# EAGLE design PIC SENSOR-BOARD (EAGLE 9.2.2)

## Sheet 1 of 2
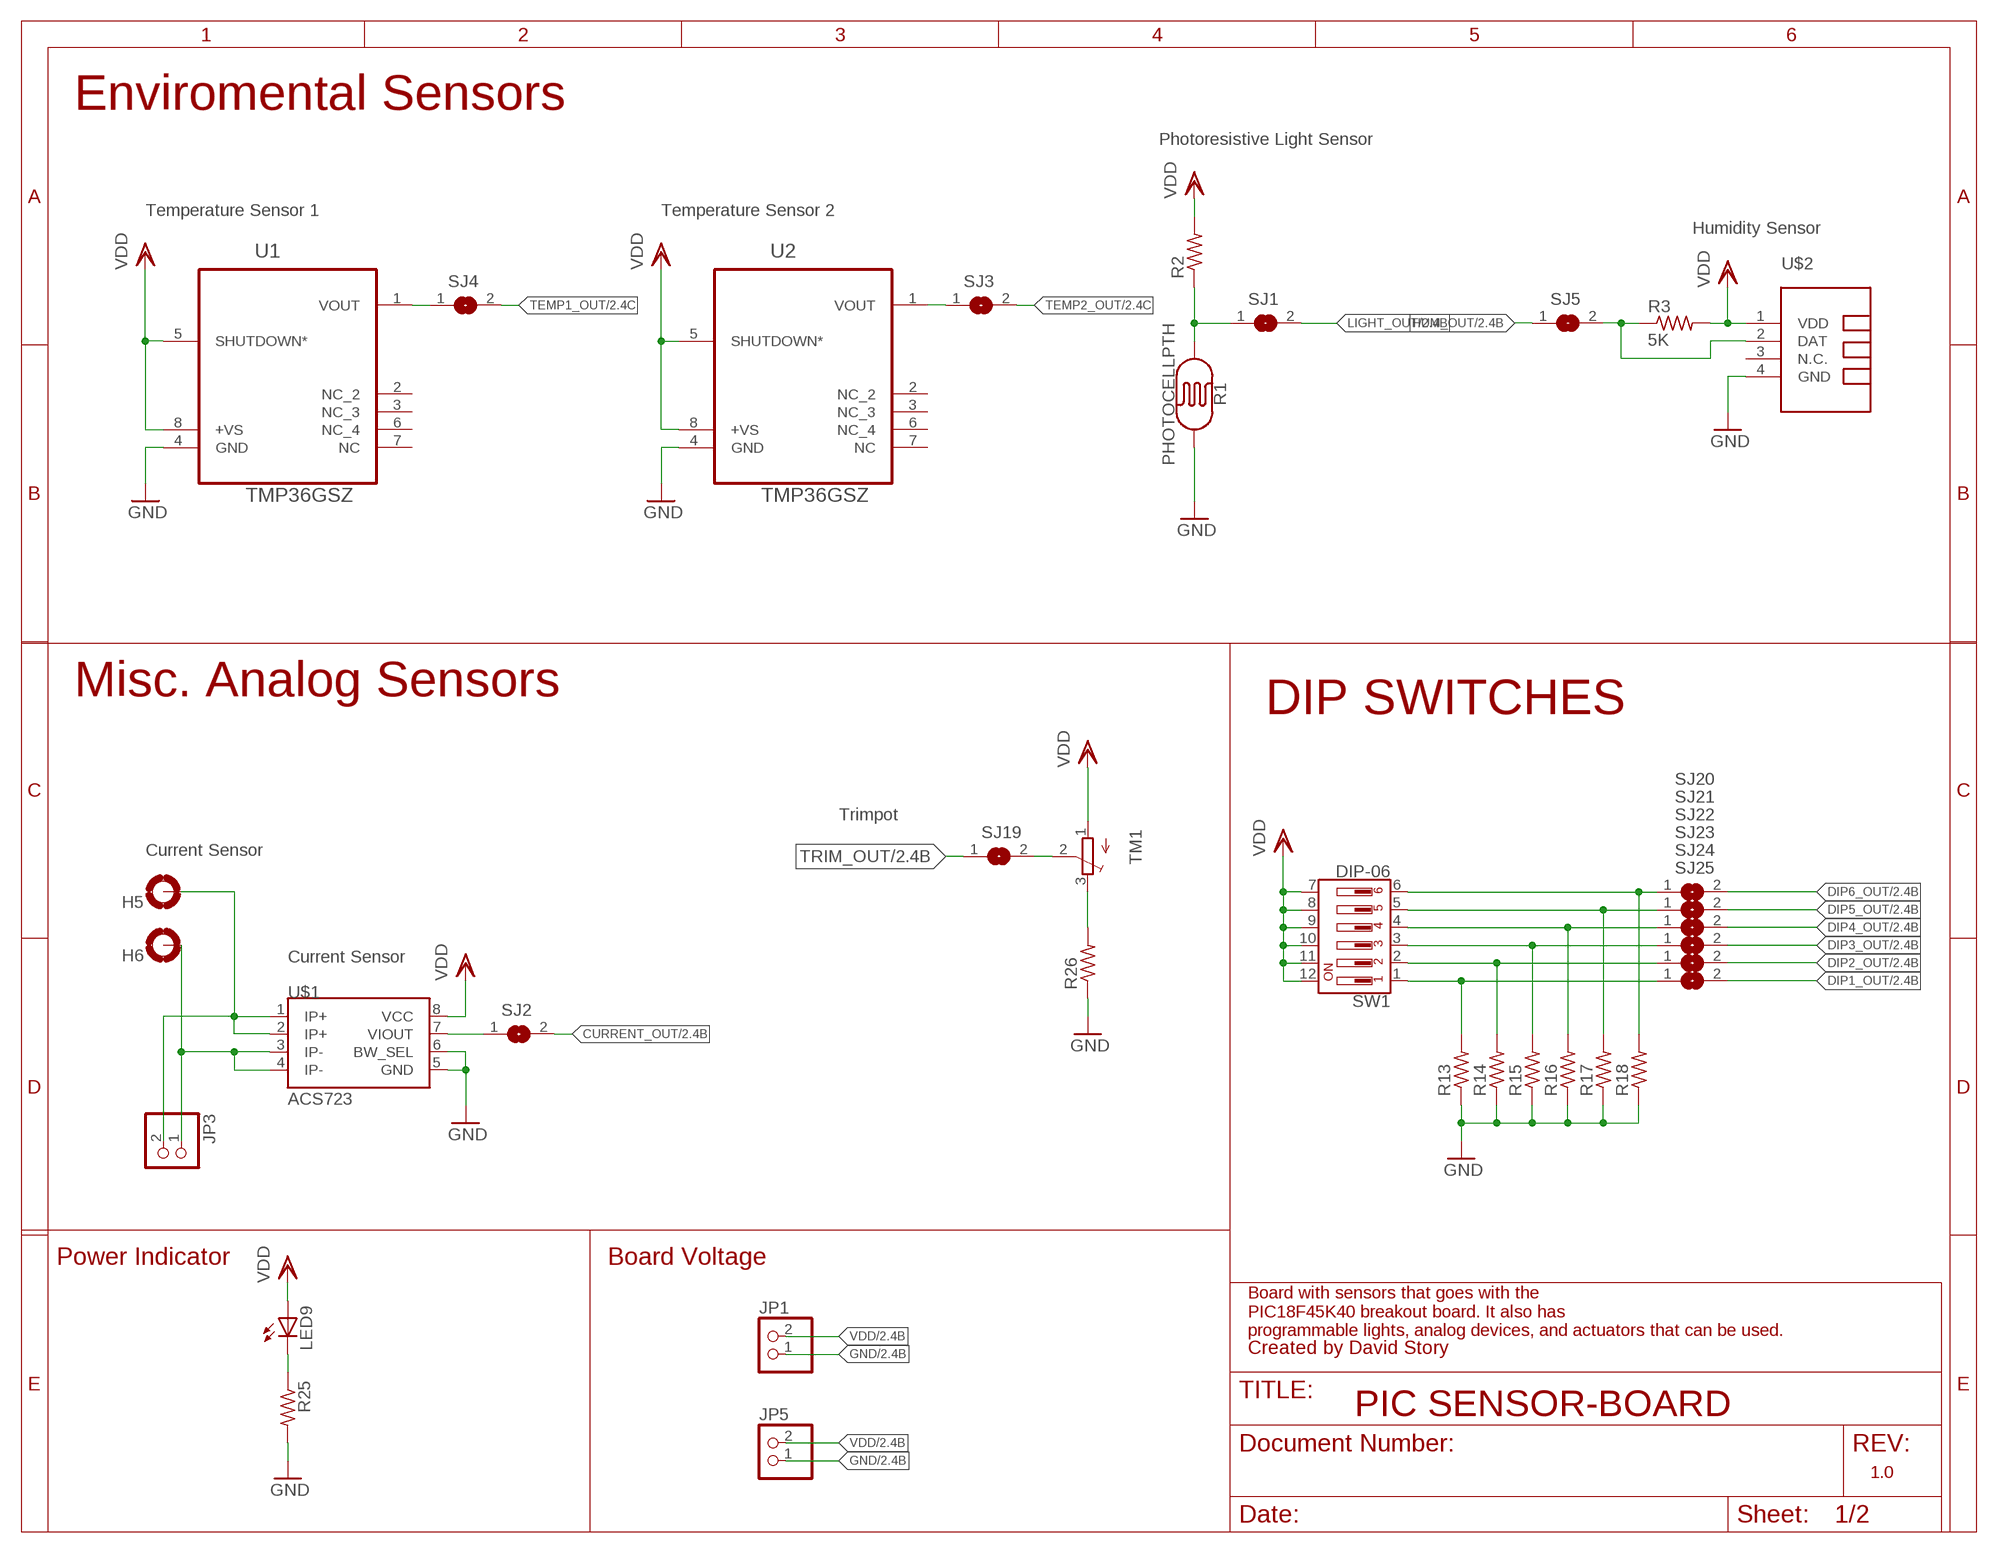
[diagram p0: schematic, sheet 1]

### Parts
H5  MOUNT-PAD-ROUND3.3  [3,3-PAD]
H6  MOUNT-PAD-ROUND3.3  [3,3-PAD]
JP1  PINHD-1X2  [1X02]
JP3  PINHD-1X2  [1X02]
JP5  PINHD-1X2  [1X02]
LED9  LEDCHIPLED_0603  [CHIPLED_0603]
R1  PHOTOCELLPTH  [PHOTOCELL]
R2  R-US_M0805  [M0805]
R3  5K  R-US_M0805  [M0805]
R13  R-US_R0805  [R0805]
R14  R-US_R0805  [R0805]
R15  R-US_R0805  [R0805]
R16  R-US_R0805  [R0805]
R17  R-US_R0805  [R0805]
R18  R-US_R0805  [R0805]
R25  R-US_M0805  [M0805]
R26  R-US_M0805  [M0805]
SJ1  SJ  [SJ]
SJ2  SJ  [SJ]
SJ3  SJ  [SJ]
SJ4  SJ  [SJ]
SJ5  SJ  [SJ]
SJ19  SJ  [SJ]
SJ20  SJ  [SJ]
SJ21  SJ  [SJ]
SJ22  SJ  [SJ]
SJ23  SJ  [SJ]
SJ24  SJ  [SJ]
SJ25  SJ  [SJ]
SW1  DIP-06  [DIPSWITCH-06-SMD]
TM1  TRIMPOT3386  [TRIM-3386]
U1  TMP36GSZ  [SOIC127P600X175-8N]
U2  TMP36GSZ  [SOIC127P600X175-8N]
U$1  ACS723  [SO08]
U$2  TEMP-HUM-SENSOR-DHT11  [TEMP-HUM-SENSOR-DHT11]

### Nets
CURRENT_LINE: SJ2.1 U$1.7(VIOUT)
CURRENT_OUT: SJ2.2 ; also sheet 2
DIP1_LINE: R13.2 SJ25.1 SW1.1
DIP1_OUT: SJ25.2 ; also sheet 2
DIP2_LINE: R14.2 SJ24.1 SW1.2
DIP2_OUT: SJ24.2 ; also sheet 2
DIP3_LINE: R15.2 SJ23.1 SW1.3
DIP3_OUT: SJ23.2 ; also sheet 2
DIP4_LINE: R16.2 SJ22.1 SW1.4
DIP4_OUT: SJ22.2 ; also sheet 2
DIP5_LINE: R17.2 SJ21.1 SW1.5
DIP5_OUT: SJ21.2 ; also sheet 2
DIP6_LINE: R18.2 SJ20.1 SW1.6
DIP6_OUT: SJ20.2 ; also sheet 2
GND: JP1.1 JP5.1 R1.2 R13.1 R14.1 R15.1 R16.1 R17.1 R18.1 R25.2 R26.1 U1.4(GND) U2.4(GND) U$1.5(GND) U$1.6(BW_SEL) U$2.4(GND) ; also sheet 2
HUM_DATA: R3.1 SJ5.2 U$2.2(DAT)
HUM_OUT: SJ5.1 ; also sheet 2
IP+: H5.B3,3(MOUNT) JP3.2 U$1.1(IP+) U$1.2(IP+)
IP-: H6.B3,3(MOUNT) JP3.1 U$1.3(IP-) U$1.4(IP-)
LIGHT_LINE: R1.1 R2.1 SJ1.1
LIGHT_OUT: SJ1.2 ; also sheet 2
POWER-: LED9.C R25.1
T1_LINE: SJ4.1 U1.1(VOUT)
T2_LINE: SJ3.1 U2.1(VOUT)
TEMP1_OUT: SJ4.2 ; also sheet 2
TEMP2_OUT: SJ3.2 ; also sheet 2
TRIM: R26.2 TM1.3(E)
TRIM_JUMP: SJ19.2 TM1.2(S)
TRIM_OUT: SJ19.1 ; also sheet 2
VDD: JP1.2 JP5.2 LED9.A R2.2 R3.2 SW1.7 SW1.8 SW1.9 SW1.10 SW1.11 SW1.12 TM1.1(A) U1.5(SHUTDOWN*) U1.8(+VS) U2.5(SHUTDOWN*) U2.8(+VS) U$1.8(VCC) U$2.1(VDD) ; also sheet 2
Unconnected: U1.2(NC_2) U1.3(NC_3) U1.6(NC_4) U1.7(NC) U2.2(NC_2) U2.3(NC_3) U2.6(NC_4) U2.7(NC) U$2.3(N.C.)

### Notes on the sheet
- Enviromental Sensors
- Photoresistive Light Sensor
- Temperature Sensor 1 | Temperature Sensor 2
- Humidity Sensor
- Misc. Analog Sensors
- DIP SWITCHES
- Trimpot
- Current Sensor
- Current Sensor
- Power Indicator | Board Voltage
- Board with sensors that goes with the
  PIC18F45K40 breakout board. It also has
  programmable lights, analog devices, and actuators that can be used.
- Created by David Story
- 1.0

## Sheet 2 of 2
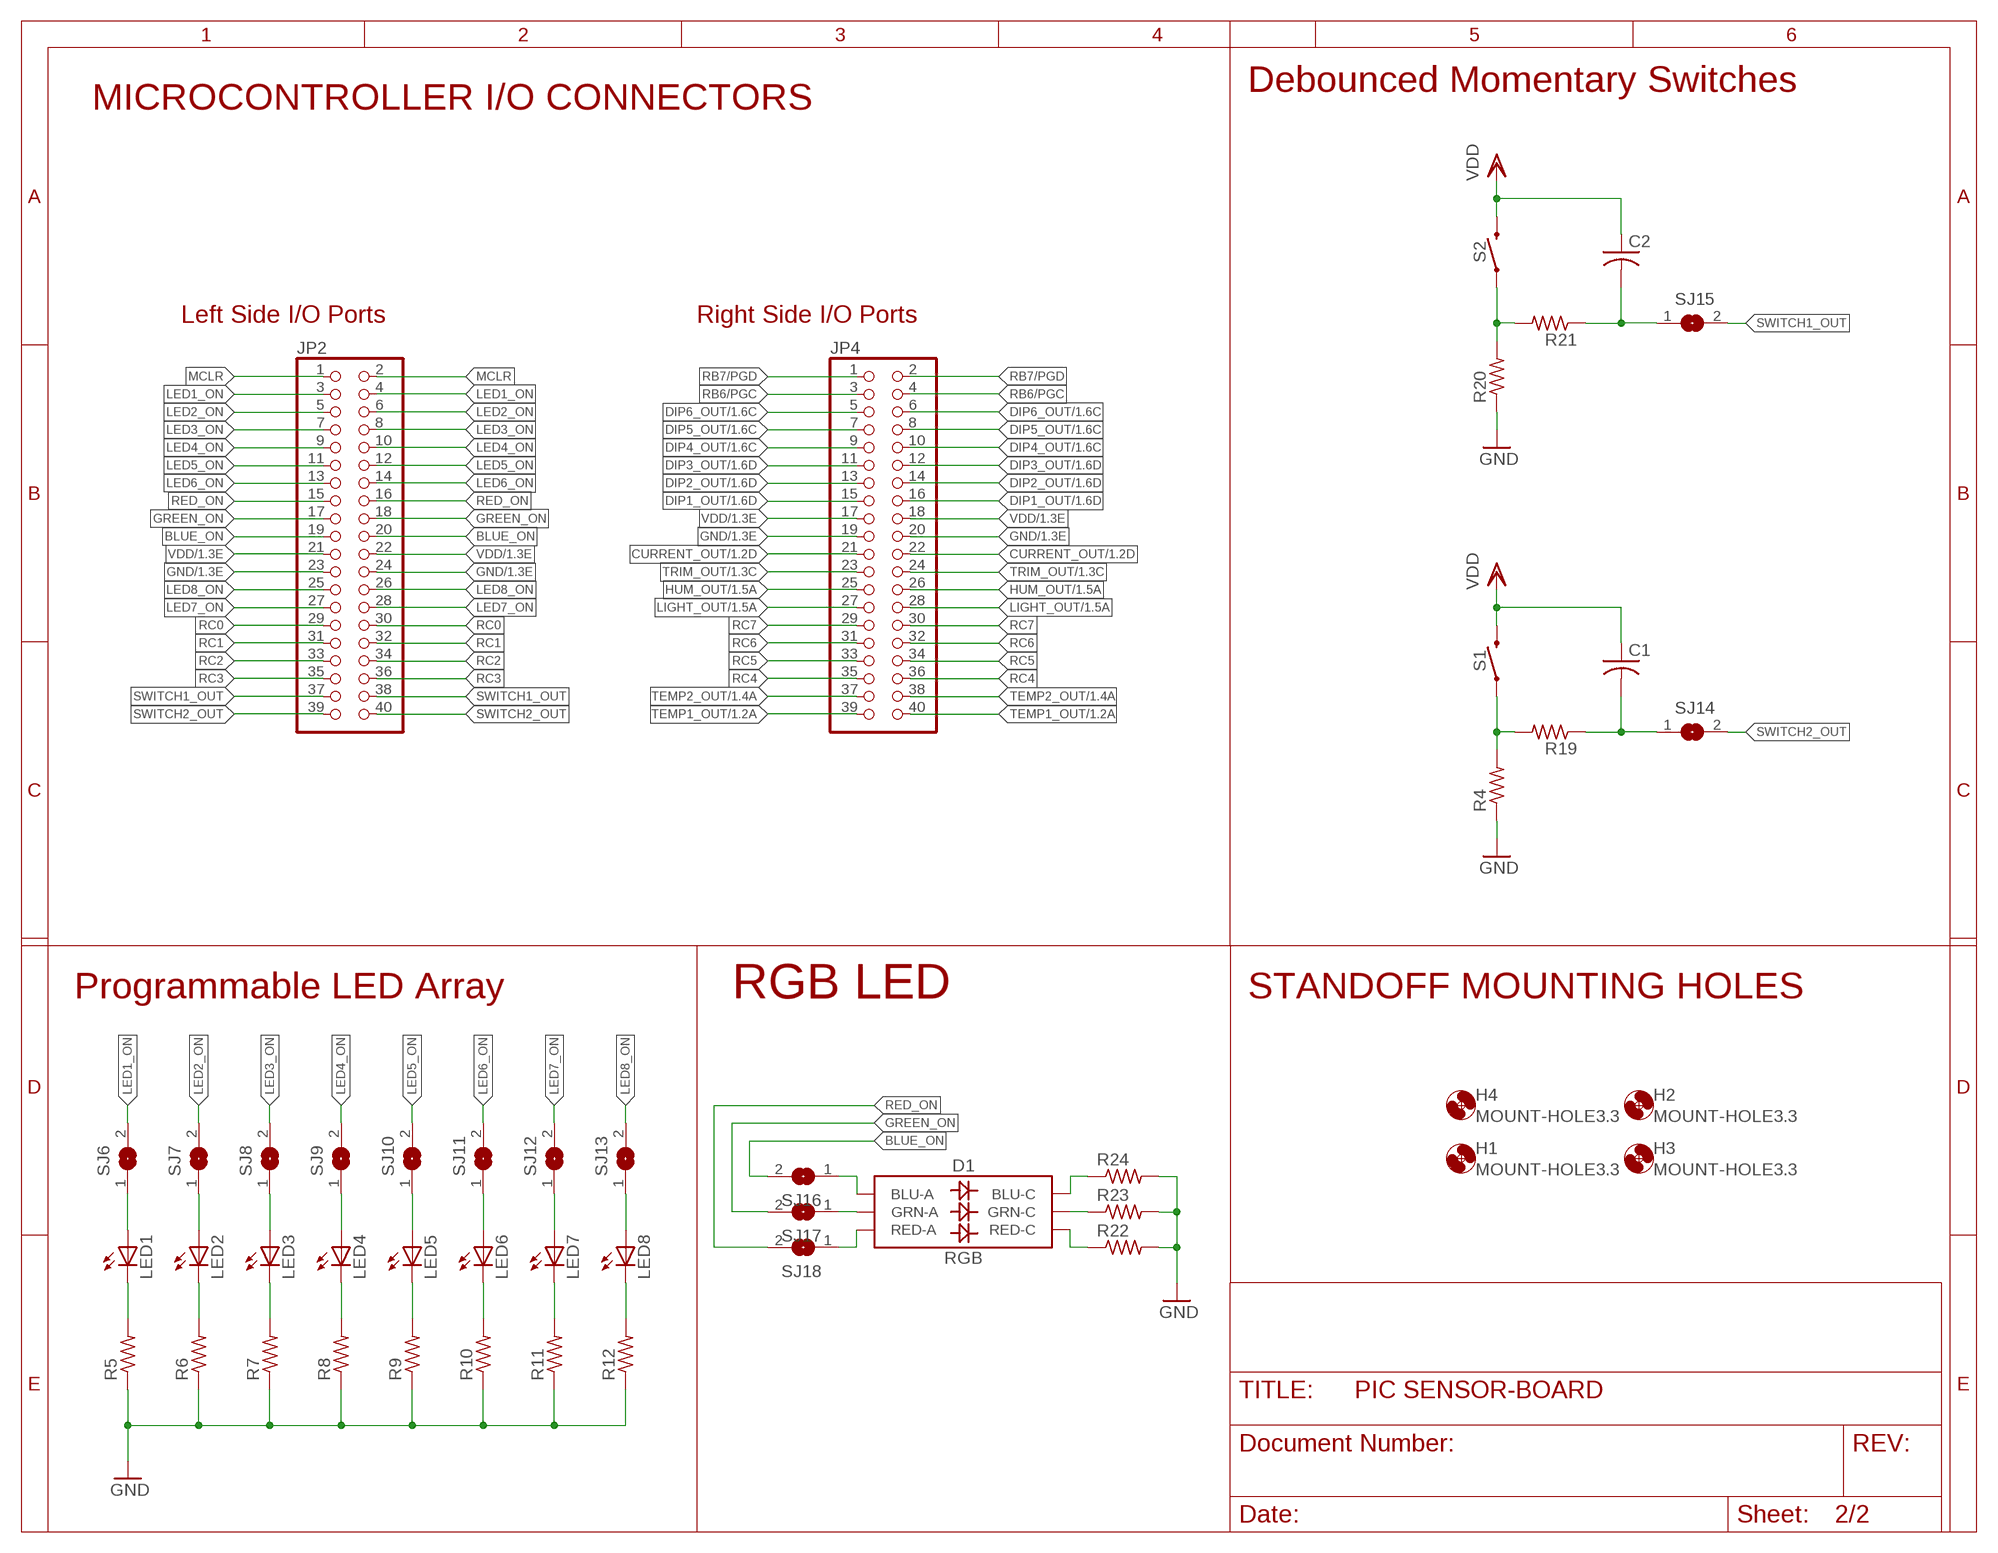
[diagram p1: schematic, sheet 2]

### Parts
C1  C-USC0805  [C0805]
C2  C-USC0805  [C0805]
D1  RGB  LED-RGBPLCC-6  [PLCC-6-LED]
H1  MOUNT-HOLE3.3  [3,3]
H2  MOUNT-HOLE3.3  [3,3]
H3  MOUNT-HOLE3.3  [3,3]
H4  MOUNT-HOLE3.3  [3,3]
JP2  PINHD-2X20  [2X20]
JP4  PINHD-2X20  [2X20]
LED1  LEDSML0603  [SML0603]
LED2  LEDSML0603  [SML0603]
LED3  LEDSML0603  [SML0603]
LED4  LEDSML0603  [SML0603]
LED5  LEDSML0603  [SML0603]
LED6  LEDSML0603  [SML0603]
LED7  LEDSML0603  [SML0603]
LED8  LEDSML0603  [SML0603]
R4  R-US_M0805  [M0805]
R5  R-US_M0805  [M0805]
R6  R-US_M0805  [M0805]
R7  R-US_M0805  [M0805]
R8  R-US_M0805  [M0805]
R9  R-US_M0805  [M0805]
R10  R-US_M0805  [M0805]
R11  R-US_M0805  [M0805]
R12  R-US_M0805  [M0805]
R19  R-US_M0805  [M0805]
R20  R-US_M0805  [M0805]
R21  R-US_M0805  [M0805]
R22  R-US_R0805  [R0805]
R23  R-US_R0805  [R0805]
R24  R-US_R0805  [R0805]
S1  MOMENTARY-SWITCH-SPST-PTH-6.0MM  [TACTILE_SWITCH_PTH_6.0MM]
S2  MOMENTARY-SWITCH-SPST-PTH-6.0MM  [TACTILE_SWITCH_PTH_6.0MM]
SJ6  SJ  [SJ]
SJ7  SJ  [SJ]
SJ8  SJ  [SJ]
SJ9  SJ  [SJ]
SJ10  SJ  [SJ]
SJ11  SJ  [SJ]
SJ12  SJ  [SJ]
SJ13  SJ  [SJ]
SJ14  SJ  [SJ]
SJ15  SJ  [SJ]
SJ16  SJ  [SJ]
SJ17  SJ  [SJ]
SJ18  SJ  [SJ]

### Nets
BLUE+: D1.AB(BLU-A) SJ16.1
BLUE-: D1.CB(BLU-C) R24.1
BLUE_ON: JP2.19 JP2.20 SJ16.2
CAP2_NEG: C1.2 R19.1 SJ14.1
CAP_NEG: C2.2 R21.1 SJ15.1
CURRENT_OUT: JP4.21 JP4.22 ; also sheet 1
DIP1_OUT: JP4.15 JP4.16 ; also sheet 1
DIP2_OUT: JP4.13 JP4.14 ; also sheet 1
DIP3_OUT: JP4.11 JP4.12 ; also sheet 1
DIP4_OUT: JP4.9 JP4.10 ; also sheet 1
DIP5_OUT: JP4.7 JP4.8 ; also sheet 1
DIP6_OUT: JP4.5 JP4.6 ; also sheet 1
GND: JP2.23 JP2.24 JP4.19 JP4.20 R4.1 R5.1 R6.1 R7.1 R8.1 R9.1 R10.1 R11.1 R12.1 R20.1 R22.2 R23.2 R24.2 ; also sheet 1
GREEN+: D1.AG(GRN-A) SJ17.1
GREEN-: D1.CG(GRN-C) R23.1
GREEN_ON: JP2.17 JP2.18 SJ17.2
HUM_OUT: JP4.25 JP4.26 ; also sheet 1
L1+: LED1.A SJ6.1
L1-: LED1.C R5.2
L2+: LED2.A SJ7.1
L2-: LED2.C R6.2
L3+: LED3.A SJ8.1
L3-: LED3.C R7.2
L4+: LED4.A SJ9.1
L4-: LED4.C R8.2
L5+: LED5.A SJ10.1
L5-: LED5.C R9.2
L6+: LED6.A SJ11.1
L6-: LED6.C R10.2
L7+: LED7.A SJ12.1
L7-: LED7.C R11.2
L8+: LED8.A SJ13.1
L8-: LED8.C R12.2
LED1_ON: JP2.3 JP2.4 SJ6.2
LED2_ON: JP2.5 JP2.6 SJ7.2
LED3_ON: JP2.7 JP2.8 SJ8.2
LED4_ON: JP2.9 JP2.10 SJ9.2
LED5_ON: JP2.11 JP2.12 SJ10.2
LED6_ON: JP2.13 JP2.14 SJ11.2
LED7_ON: JP2.27 JP2.28 SJ12.2
LED8_ON: JP2.25 JP2.26 SJ13.2
LIGHT_OUT: JP4.27 JP4.28 ; also sheet 1
MCLR: JP2.1 JP2.2
RB6/PGC: JP4.3 JP4.4
RB7/PGD: JP4.1 JP4.2
RC0: JP2.29 JP2.30
RC1: JP2.31 JP2.32
RC2: JP2.33 JP2.34
RC3: JP2.35 JP2.36
RC4: JP4.35 JP4.36
RC5: JP4.33 JP4.34
RC6: JP4.31 JP4.32
RC7: JP4.29 JP4.30
RED+: D1.AR(RED-A) SJ18.1
RED-: D1.CR(RED-C) R22.1
RED_ON: JP2.15 JP2.16 SJ18.2
SW_NEG: R20.2 R21.2 S2.1
SW_NEG2: R4.2 R19.2 S1.1
SWITCH1_OUT: JP2.37 JP2.38 SJ15.2
SWITCH2_OUT: JP2.39 JP2.40 SJ14.2
TEMP1_OUT: JP4.39 JP4.40 ; also sheet 1
TEMP2_OUT: JP4.37 JP4.38 ; also sheet 1
TRIM_OUT: JP4.23 JP4.24 ; also sheet 1
VDD: C1.1 C2.1 JP2.21 JP2.22 JP4.17 JP4.18 S1.3 S2.3 ; also sheet 1

### Notes on the sheet
- Debounced Momentary Switches
- MICROCONTROLLER I/O CONNECTORS
- Left Side I/O Ports | Right Side I/O Ports
- Programmable LED Array | RGB LED | STANDOFF MOUNTING HOLES

## Library data of the parts
C1 C2 = rcl:C-US: CAPACITOR, American symbol; SPICEPREFIX: C
D1 = SparkFun-LED:LED-RGB: LED-RGB 6 pin RGB LED (no common connector) Packages: PLCC-6 LED-TRICOLOR-5050 - No built-in IC SparkFun Products: Digital Sandbox <https://www.sparkfun.com/products/12651> LED- SMD RGB <https://www.sparkfun.com/products/10866>; PROD_ID: DIO-12113
H1-H4 = holes:MOUNT-HOLE: MOUNTING HOLE with drill center marker
H5 H6 = holes:MOUNT-PAD-ROUND: MOUNTING PAD, round
JP1 JP3 JP5 = pinhead:PINHD-1X2: PIN HEADER
JP2 JP4 = adafruit:PINHD-2X20: PIN HEADER
LED1-LED9 = led:LED: LED OSRAM: - CHIPLED LG R971, LG N971, LY N971, LG Q971, LY Q971, LO R971, LY R971 LH N974, LH R974 LS Q976, LO Q976, LY Q976 LO Q996 - Hyper CHIPLED LW Q18S LB Q993, LB Q99A, LB R99A - SideLED LS A670, LO A670, LY A670, LG A670, LP A670 LB A673, LV A673, LT A673, LW A673 LH A674 LY A675 LS A676, LA A676, LO A676, LY A676, LW A676 LS A679, LY A679, LG A679 - Hyper Micro SIDELED® LS Y876, LA Y876, LO Y876, LY Y876 LT Y87S - SmartLED LW L88C, LW L88S LB L89C, LB L89S, LG L890 LS L89K, LO L89K, LY L89K LS L896, LA L896, LO L896, LY L896 - TOPLED LS T670, LO T670, LY T670, LG T670, LP T670 LSG T670, LSP T670, LSY T670, LOP T670, LYG T670 LG T671, LOG T671, LSG T671 LB T673, LV T673, LT T673, LW T673 LH T674 LS T676, LA T676, LO T676, LY T676, LB T676, LH T676, LSB T676, LW T676 LB T67C, LV T67C, LT T67C, LS T67K, LO T67K, LY T67K, LW E67C LS E67B, LA E67B, LO E67B, LY E67B, LB E67C, LV E67C, LT E67C LW T67C LS T679, LY T679, LG T679 LS T770, LO T770, LY T770, LG T770, LP T770 LB T773, LV T773, LT T773, LW T773 LH T774 LS E675, LA E675, LY E675, LS T675 LS T776, LA T776, LO T776, LY T776, LB T776 LHGB T686 LT T68C, LB T68C - Hyper Mini TOPLED® LB M676 - Mini TOPLED Santana® LG M470 LS M47K, LO M47K, LY M47K Source: http://www.osram.convergy.de LUXEON: - LUMILED® LXK2-PW12-R00, LXK2-PW12-S00, LXK2-PW14-U00, LXK2-PW14-V00 LXK2-PM12-R00, LXK2-PM12-S00, LXK2-PM14-U00 LXK2-PE12-Q00, LXK2-PE12-R00, LXK2-PE12-S00, LXK2-PE14-T00, LXK2-PE14-U00 LXK2-PB12-K00, LXK2-PB12-L00, LXK2-PB12-M00, LXK2-PB14-N00, LXK2-PB14-P00, LXK2-PB14-Q00 LXK2-PR12-L00, LXK2-PR12-M00, LXK2-PR14-Q00, LXK2-PR14-R00 LXK2-PD12-Q00, LXK2-PD12-R00, LXK2-PD12-S00 LXK2-PH12-R00, LXK2-PH12-S00 LXK2-PL12-P00, LXK2-PL12-Q00, LXK2-PL12-R00 Source: www.luxeon.com KINGBRIGHT: KA-3528ASYC Source: www.kingbright.com
R1 = SparkFun-Sensors:PHOTOCELL: Photocell (Photodetector, Photo Resistor, CdS) This is a very small light sensor. A photocell changes (also called a photodetector, photo resistor, CdS or photoconductive cell) resistance depending on the amount of light it is exposed to. These little sensors make great ambient light triggers (when light in the room turns on, do something). Datasheet <http://cdn.sparkfun.com/datasheets/Sensors/LightImaging/SEN-09088.pdf> SparkFun Products Mini Photocell <https://www.sparkfun.com/products/9088> (SEN-09088); PROD_ID: COMP-09129; SF_ID: SEN-09088
R2-R26 = rcl:R-US_: RESISTOR, American symbol; SPICEPREFIX: R
S1 S2 = SparkFun-Switches:MOMENTARY-SWITCH-SPST: Momentary Switch (Pushbutton) - SPST Normally-open (NO) SPST momentary switches (buttons, pushbuttons). Variants PTH-12MM - 12mm square, through-hole Momentary Pushbutton Switch - 12mm Square <https://www.sparkfun.com/products/9190> (COM-09190) PTH-6.0MM, PTH-6.0MM-KIT - 6.0mm square, through-hole Mini Pushbutton Switch <https://www.sparkfun.com/products/97> (COM-00097) KIT package intended for soldering kit's - only one side of pads' copper is exposed. PTH-RIGHT-ANGLE-KIT - Right-angle, through-hole Right Angle Tactile Button <https://www.sparkfun.com/products/10791> - Used on SparkFun BigTime Watch Kit <https://www.sparkfun.com/products/11734> SMD-12MM - 12mm square, surface-mount Tactile Button - SMD (12mm) <https://www.sparkfun.com/products/12993> (COM-12993) Used on SparkFun PicoBoard <https://www.sparkfun.com/products/11888> SMD-4.5MM - 4.5mm Square Trackball Switch Used on SparkFun Blackberry Trackballer Breakout <https://www.sparkfun.com/products/13169> SMD-4.6MMX2.8MM - 4.60mm x 2.80mm, surface mount Used on SparkFun SAMD21 Mini Breakout <https://www.sparkfun.com/products/13664> SMD-5.2MM, SMD-5.2-REDUNDANT - 5.2mm square, surface-mount Mini Pushbutton Switch - SMD <https://www.sparkfun.com/products/8720> (COM-08720) Used on Arduino Pro Mini <https://www.sparkfun.com/products/11114> REDUNDANT package connects both switch circuits together SMD-6.0X3.5MM - 6.0 x 3.5mm, surface mount Momentary Reset Switch SMD <https://www.sparkfun.com/products/8229> (COM-08229) SMD-6.2MM-TALL - 6.2mm square, surface mount Tactile Button - SMD (6mm) <https://www.sparkfun.com/products/12992> Used on SparkFun Digital Sandbox <https://www.sparkfun.com/products/12651> SMD-RIGHT-ANGLE - Right-angle, surface mount Used on SparkFun Block for Intel® Edison - Arduino <https://www.sparkfun.com/products/13036>; PROD_ID: SWCH-08441; SF_SKU: COM-00097
SJ1-SJ25 = jumper:SJ: SMD solder JUMPER
SW1 = SparkFun-Switches:DIP-06; PROD_ID: --------
TM1 = adafruit:TRIMPOT: SMT trimmer potentiometer part number TC33X http://www.ladyada.net/library/eagle
U1 U2 = ADI-Phase-2:TMP36GSZ: Voltage Output Temperature Sensors; MPN: TMP36GSZ; OC_FARNELL: 1661086; OC_NEWARK: 19M9014; PACKAGE: SOIC-8; SUPPLIER: Analog Devices
U$1 = SparkFun-Sensors:ACS723; PART_#: ACS723ACS723LLCTR-05AB-T2; PROD_ID: IC-13872
U$2 = diy-modules:TEMP-HUM-SENSOR-DHT11: DHT11 - digital humidity & temperature sensor DHT11 datasheet available here: https://akizukidenshi.com/download/ds/aosong/DHT11.pdf Click here to find device on ebay.com <http://www.ebay.com/sch/dht11+digital+sensor>

## Board
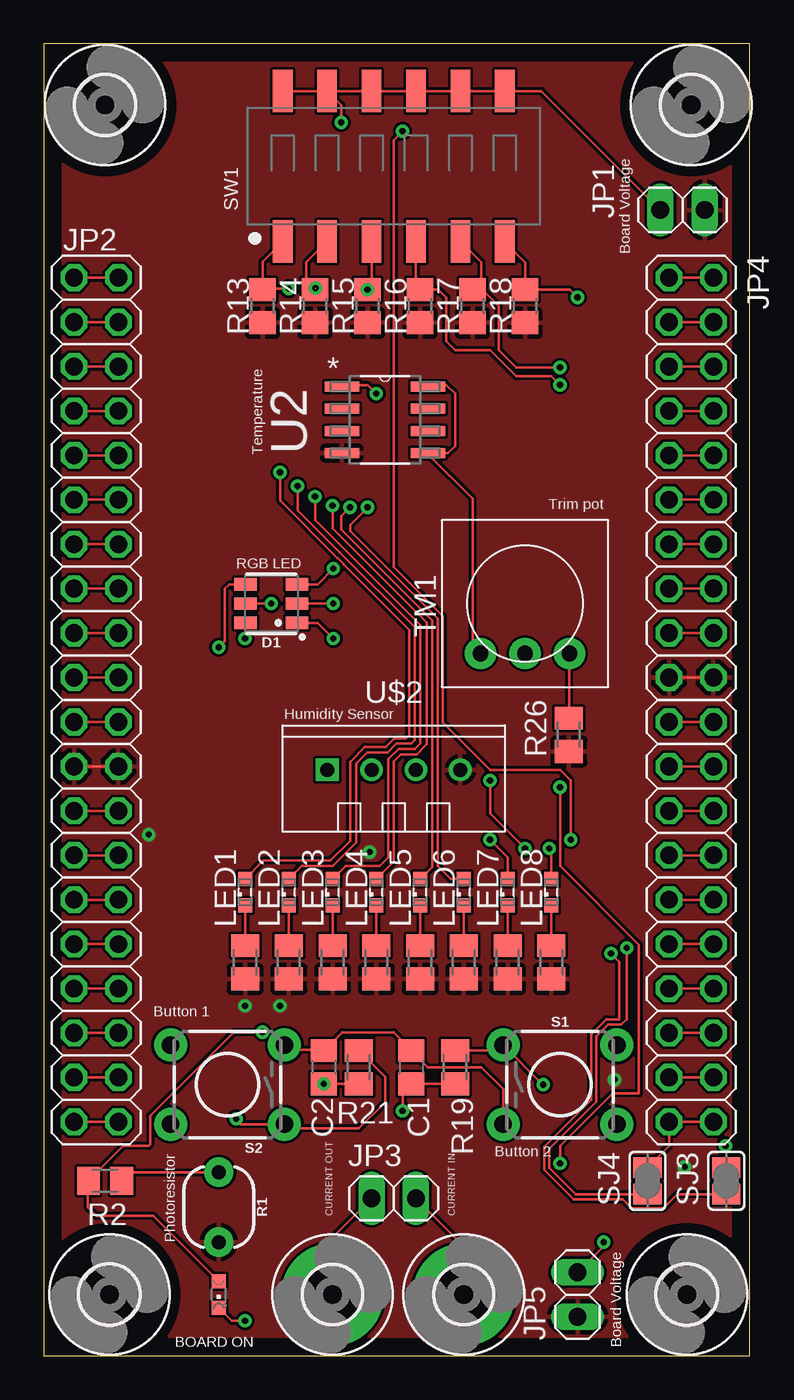
[diagram p2: board, top side]
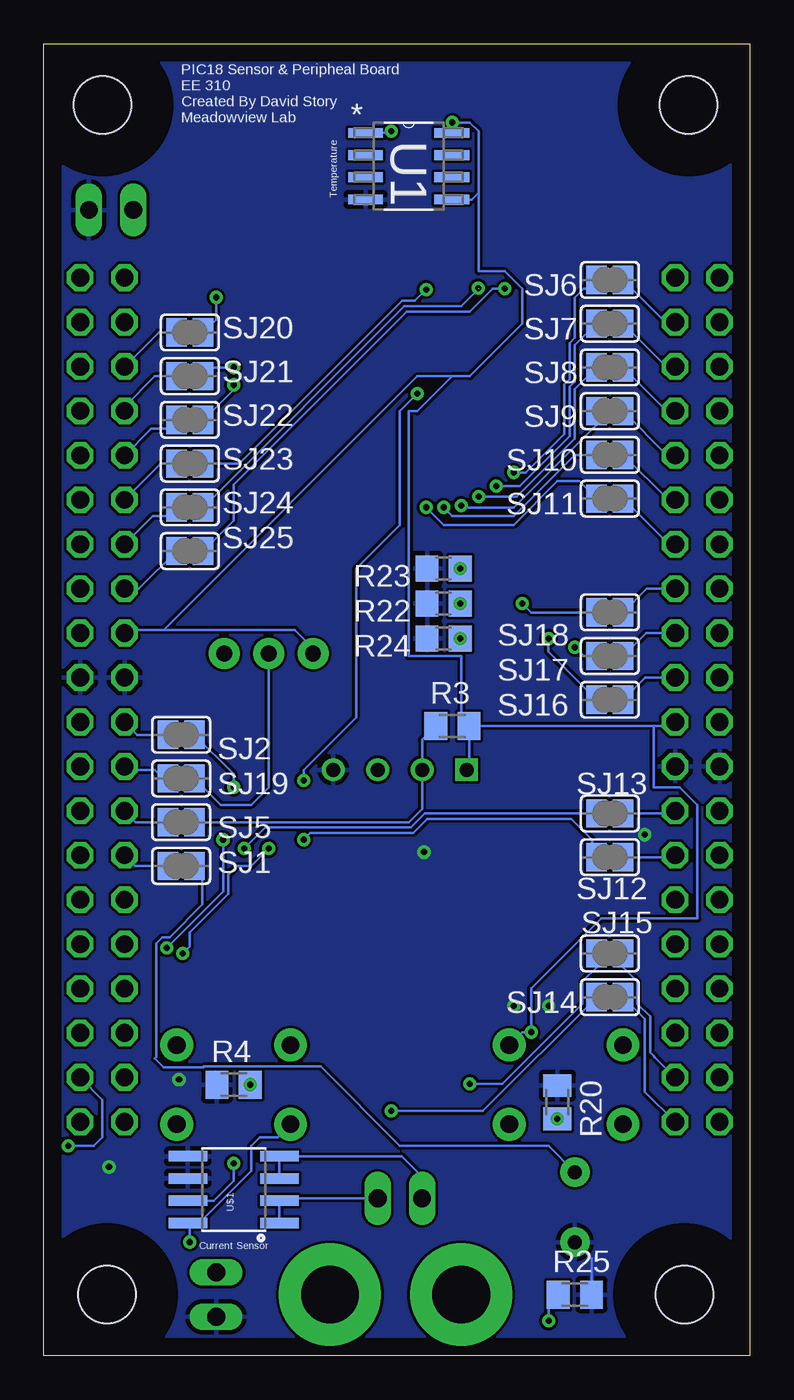
[diagram p3: board, bottom side, seen from below]

Size 40.35 x 75 mm. Coordinates in mm from the lower left corner, seen from the top.
Outline: 0,0 40.35,0 40.35,75 0,75 0,0
Copper layers (1*16): Top 0.035mm / dielectric 1.5mm / Bottom 0.035mm
Design rules "default": minimum track width 6mil, minimum drill 0.35mm, track to track 6mil, track to pad 6mil, pad to pad 6mil, via to via 6mil, smd to smd 6mil, copper to edge 40mil, drill to drill 6mil, minimum pad ring 10mil, minimum via ring 8mil, stop-mask expansion 4mil, vias tented up to drill 0mil, thermal gap 10mil

### Footprints (pad centres in the part's own frame; a part is rotated, then mirrored left to right if it is on the bottom)
C0805 = smd 1.3 x 1.5: 1 -0.95,0; 2 0.95,0
PLCC-6-LED = smd 1.3 x 0.7: AB 1.475,1.1; AG 1.475,-1.1; AR 1.475,0; CB -1.475,1.1; CG -1.475,-1.1; CR -1.475,0
3,3 = hole 3.3: 0,0
3,3-PAD = drill 3.3 pad 5.842: B3,3 0,0
1X02 = drill 1.016 long: 1 -1.27,0; 2 1.27,0
2X20 = drill 1.016 octagon: 1 -24.13,-1.27; 2 -24.13,1.27; 3 -21.59,-1.27; 4 -21.59,1.27; 5 -19.05,-1.27; 6 -19.05,1.27; 7 -16.51,-1.27; 8 -16.51,1.27; 9 -13.97,-1.27; 10 -13.97,1.27; 11 -11.43,-1.27; 12 -11.43,1.27; 13 -8.89,-1.27; 14 -8.89,1.27; 15 -6.35,-1.27; 16 -6.35,1.27; 17 -3.81,-1.27; 18 -3.81,1.27; 19 -1.27,-1.27; 20 -1.27,1.27; 21 1.27,-1.27; 22 1.27,1.27; 23 3.81,-1.27; 24 3.81,1.27; 25 6.35,-1.27; 26 6.35,1.27; 27 8.89,-1.27; 28 8.89,1.27; 29 11.43,-1.27; 30 11.43,1.27; 31 13.97,-1.27; 32 13.97,1.27; 33 16.51,-1.27; 34 16.51,1.27; 35 19.05,-1.27; 36 19.05,1.27; 37 21.59,-1.27; 38 21.59,1.27; 39 24.13,-1.27; 40 24.13,1.27
SML0603 = smd 0.8 x 0.8: A 0.75,0; C -0.75,0
CHIPLED_0603 = smd 0.8 x 0.8: A 0,-0.75; C 0,0.75
PHOTOCELL = drill 0.8 pad 1.676: 1 -2,0; 2 2,0
M0805 = smd 1.3 x 1.6: 1 -0.95,0; 2 0.95,0
R0805 = smd 1.3 x 1.5: 1 -0.95,0; 2 0.95,0
TACTILE_SWITCH_PTH_6.0MM = drill 1.016 pad 1.88: 1 -3.251,2.261; 2 3.251,2.261; 3 -3.251,-2.261; 4 3.251,-2.261
SJ = smd 1.168 x 1.6: 1 -0.762,0; 2 0.762,0
DIPSWITCH-06-SMD = smd 1.13 x 2.44: 1 -6.35,-4.3; 2 -3.81,-4.3; 3 -1.27,-4.3; 4 1.27,-4.3; 5 3.81,-4.3; 6 6.35,-4.3; 7 6.35,4.3; 8 3.81,4.3; 9 1.27,4.3; 10 -1.27,4.3; 11 -3.81,4.3; 12 -6.35,4.3
TRIM-3386 = drill 0.9 pad 1.778: 1 -2.54,-2.857; 2 0,-2.857; 3 2.54,-2.857
SOIC127P600X175-8N = smd 1.981 x 0.559: 1 -2.464,1.905; 2 -2.464,0.635; 3 -2.464,-0.635; 4 -2.464,-1.905; 5 2.464,-1.905; 6 2.464,-0.635; 7 2.464,0.635; 8 2.464,1.905
SO08 = smd 0.61 x 2.21: 1 -1.905,-2.616; 2 -0.635,-2.616; 3 0.635,-2.616; 4 1.905,-2.616; 5 1.905,2.616; 6 0.635,2.616; 7 -0.635,2.616; 8 -1.905,2.616
TEMP-HUM-SENSOR-DHT11 = drill 0.8 square: 1 -3.81,0 | drill 0.8: 2 -1.27,0; 3 1.27,0; 4 3.81,0

### Placement (x,y rotation side)
C1  21,16.5 270 top
C2  16,16.5 270 top
D1  13,43 180 top
H1  36.75,3.5 0 top
H2  3.75,3.5 0 top
H3  37,71.5 0 top
H4  3.5,71.5 0 top
H5  24,3.5 0 top
H6  16.5,3.5 0 top
JP1  36.5,65.5 180 top
JP2  3,37.5 270 top
JP3  20,9 0 top
JP4  37,37.5 270 top
JP5  30.5,3.5 90 top
LED1  11.5,26.5 90 top
LED2  14,26.5 90 top
LED3  16.5,26.5 90 top
LED4  19,26.5 90 top
LED5  21.5,26.5 90 top
LED6  24,26.5 90 top
LED7  26.5,26.5 90 top
LED8  29,26.5 90 top
LED9  10,3.5 180 top
R1  10,8.5 270 top
R2  3.5,10 180 top
R3  17,36 0 bottom
R4  29.5,15.5 0 bottom
R5  11.5,22.5 90 top
R6  14,22.5 90 top
R7  16.5,22.5 90 top
R8  19,22.5 90 top
R9  21.5,22.5 90 top
R10  24,22.5 90 top
R11  26.5,22.5 90 top
R12  29,22.5 90 top
R13  12.5,60 90 top
R14  15.5,60 90 top
R15  18.5,60 90 top
R16  21.5,60 90 top
R17  24.5,60 90 top
R18  27.5,60 90 top
R19  23.5,16.5 90 top
R20  11,14.5 270 bottom
R21  18,16.5 90 top
R22  17.5,43 180 bottom
R23  17.5,45 180 bottom
R24  17.5,41 180 bottom
R25  10,3.5 0 bottom
R26  30,35.5 90 top
S1  29.5,15.5 0 top
S2  10.5,15.5 180 top
SJ1  32.5,28 180 bottom
SJ2  32.5,35.5 180 bottom
SJ3  39,10 90 top
SJ4  34.5,10 90 top
SJ5  32.5,30.5 0 bottom
SJ6  8,61.5 0 bottom
SJ7  8,59 0 bottom
SJ8  8,56.5 0 bottom
SJ9  8,54 0 bottom
SJ10  8,51.5 0 bottom
SJ11  8,49 0 bottom
SJ12  8,28.5 0 bottom
SJ13  8,31 0 bottom
SJ14  8,20.5 0 bottom
SJ15  8,23 0 bottom
SJ16  8,37.5 0 bottom
SJ17  8,40 0 bottom
SJ18  8,42.5 0 bottom
SJ19  32.5,33 0 bottom
SJ20  32,58.5 180 bottom
SJ21  32,56 180 bottom
SJ22  32,53.5 180 bottom
SJ23  32,51 180 bottom
SJ24  32,48.5 180 bottom
SJ25  32,46 180 bottom
SW1  20,68 0 top
TM1  27.5,43 0 top
U1  19.5,68 0 bottom
U2  19.5,53.5 0 top
U$1  29.5,9.5 90 bottom
U$2  20,33.5 0 top

### Tracks (layer width: path | path; a pad name or v marks a point on that pad's centre or on a via)
BLUE+  (via drill 0.35)
  Top 0.152: v11.5,41 11.5,42 D1.AB
  Bottom 0.152: SJ16.1 11.53,40.26 11.53,40.98 v11.5,41
BLUE-  (via drill 0.35)
  Top 0.152: D1.CB 15.65,41.9 R24.1
  other vias: 16.55,41
BLUE_ON
  Top 0.152: JP2.19 JP2.20
  Bottom 0.152: SJ16.2 5.97,38.77 JP2.20
CAP2_NEG  (via drill 0.35)
  Top 0.152: v20.5,14 20.5,15.05 C1.2 R19.1
  Bottom 0.152: SJ14.1 15.26,14 v20.5,14
CAP_NEG  (via drill 0.35)
  Top 0.152: C2.2 R21.1
  Bottom 0.152: SJ15.1 8.76,22.21 9.57,21.39 9.57,20.12 14.14,15.55 C2.2
  other vias: 16,15.55
CURRENT_LINE  (via drill 0.35)
  Top 0.152: v29.5,32.5 29.5,28 34,23.5 34,15 32.5,15 29.5,12 v29.5,11
  Bottom 0.152: SJ2.1 29.5,33.26 v29.5,32.5 | v29.5,11 29.5,10 30.64,8.87 U$1.7
CURRENT_OUT
  Top 0.152: JP4.22 JP4.21
  Bottom 0.152: SJ2.2 35,35.5 JP4.21
DIP1_LINE  (via drill 0.35)
  Top 0.152: SW1.1 12.5,62.55 R13.2 12.55,61 v14,61
  Bottom 0.152: SJ25.1 29.5,47.74 29.5,49.81 19.61,59.7 16,59.7 14.7,61 v14,61
DIP1_OUT
  Top 0.152: JP4.16 JP4.15
  Bottom 0.152: SJ25.2 34.91,43.85 JP4.15
DIP2_LINE  (via drill 0.35)  (1 unrouted)
  Top 0.152: SW1.2 15,62.51 15,61 15.5,61 R14.2
  Bottom 0.152: SJ24.1 19.74,60 16.5,60 15.53,60.97 v15.53,61.03
DIP2_OUT
  Top 0.152: JP4.14 JP4.13
  Bottom 0.152: SJ24.2 33.26,48 34.12,48 JP4.13
DIP3_LINE  (via drill 0.35)
  Top 0.152: 18.5,63.47 SW1.3 18.73,61.18 R15.2
  Bottom 0.152: SJ23.1 29.17,51 19.86,60.3 19.14,60.3 R15.2
  other vias: 18.5,60.95
DIP3_OUT
  Top 0.152: JP4.12 JP4.11
  Bottom 0.152: SJ23.2 33.66,51 JP4.11
DIP4_LINE  (via drill 0.35)
  Top 0.152: SW1.4 21.27,61.18 R16.2 22.55,60.95 23,60.5 23,58 23.5,57.5 25.5,57.5 27,56 29,56 v29.5,55.5
  Bottom 0.152: SJ22.1 29.5,55.24 v29.5,55.5
DIP4_OUT
  Top 0.152: JP4.10 JP4.9
  Bottom 0.152: SJ22.2 33.26,53 34.2,53 JP4.9
DIP5_LINE  (via drill 0.35)
  Top 0.152: SW1.5 25,62.51 25,61.45 R17.2 25.05,60.95 26,60 26,57.5 27,56.5 v29.5,56.5
  Bottom 0.152: SJ21.1 30.74,56.5 v29.5,56.5
DIP5_OUT
  Top 0.152: JP4.8 JP4.7
  Bottom 0.152: SJ21.2 34,56 35.73,54.27 JP4.7
DIP6_LINE  (via drill 0.35)
  Top 0.152: SW1.6 26.35,63.65 27.5,62.5 R18.2 30.05,60.95 v30.5,60.5
  Bottom 0.152: SJ20.1 30.5,59.24 v30.5,60.5
DIP6_OUT
  Top 0.152: JP4.6 JP4.5
  Bottom 0.152: SJ20.2 33.78,58.5 JP4.5
GND  (via drill 0.35)
  Top 0.152: JP2.23 JP2.24 | JP4.20 JP4.19
  Bottom 0.152: R25.2 9.05,5.55 R1.2
  other vias: 11.5,20 13.5,20 6,29.79 18.62,28.79 36.62,10.79 32.62,15.79
  pour Top: 0,75 40,75 40,0 0,0
  pour Bottom: 0,75 40,75 40,0 0,0
GREEN+  (via drill 0.35)
  Top 0.152: D1.AG 10.6,44.1 10.34,43.84 10.34,40.84 v10,40.5
  Bottom 0.152: SJ17.1 9.5,40 v10,40.5
GREEN-  (via drill 0.35)
  Top 0.152: D1.CG 15.65,44.1 R23.1
  other vias: 16.55,45
GREEN_ON
  Top 0.152: JP2.17 JP2.18
  Bottom 0.152: SJ17.2 5.93,41.31 JP2.18
HUM_DATA
  Bottom 0.152: R3.1 18.73,35.22 U$2.2 18.73,31.27 19.5,30.5 SJ5.2
HUM_OUT
  Top 0.152: JP4.26 JP4.25
  Bottom 0.152: SJ5.1 35.08,30.5 JP4.25
IP+
  Top 0.152: JP3.2 24,6.27 H5.B3,3
  Bottom 0.152: U$1.1 U$1.2 26.75,9 JP3.2
IP-
  Top 0.152: JP3.1 16.5,6.77 H6.B3,3
  Bottom 0.152: JP3.1 18.73,10.23 19.91,11.4 U$1.4 U$1.3
L1+  (via drill 0.35)
  Top 0.152: LED1.A 12.55,28.3 16.37,28.3 17.5,29.43 17.5,33.95 18.36,34.8 19.53,34.8 20.03,35.3 20.69,35.3 20.89,35.5 20.89,41.5 17.16,45.23 17.16,45.25 16.8,45.61 16.78,45.61 13.5,48.89 v13.5,50.5
  Bottom 0.152: SJ6.1 9.26,61 9.5,61 10,60.5 10,58.19 10.3,57.89 10.3,55.82 10.61,55.52 10.61,52.68 12.79,50.5 v13.5,50.5
L1-
  Top 0.152: LED1.C R5.2
L2+  (via drill 0.35)
  Top 0.152: LED2.A 14.75,28 16.5,28 17.85,29.35 17.85,33.87 18.48,34.5 19.66,34.5 20.15,34.99 20.99,34.99 21.2,35.2 21.2,41.64 16.93,45.91 16.91,45.91 14.5,48.32 v14.5,49.71
  Bottom 0.152: v14.5,49.71 13.15,49.71 10.3,52.56 10.3,55.39 10,55.69 10,57.76 SJ7.1
L2-
  Top 0.152: LED2.C R6.2
L3+  (via drill 0.35)
  Top 0.152: LED3.A 17.25,28 19.2,28 19.7,28.5 19.7,34.1 20.28,34.69 21.19,34.69 21.5,35 21.5,41.77 15.5,47.77 v15.5,49.11
  Bottom 0.152: SJ8.1 10,55.26 10,52.43 13.32,49.11 v15.5,49.11
L3-
  Top 0.152: LED3.C R7.2
L4+  (via drill 0.35)
  Top 0.152: LED4.A 20,28.25 20,33.98 20.4,34.38 21.31,34.38 21.89,34.96 21.89,41.9 16.5,47.29 v16.5,48.61
  Bottom 0.152: SJ9.1 8.76,53.24 13.5,48.5 16.39,48.5 v16.5,48.61
L4-
  Top 0.152: LED4.C R8.2
L5+  (via drill 0.35)
  Top 0.152: LED5.A 22.2,27.95 22.2,41.87 22.2,42.03 17,47.22 17,48 v17.5,48.5
  Bottom 0.152: SJ10.1 10,51.5 13.5,48 17,48 v17.5,48.5
L5-
  Top 0.152: LED5.C R9.2
L6+  (via drill 0.35)
  Top 0.152: LED6.A 23.25,27.25 22.5,28 22.5,42.16 17.5,47.16 17.5,47.5 v18.5,48.5
  Bottom 0.152: SJ11.1 9.76,50 11,50 13.5,47.5 17.5,47.5 v18.5,48.5
L6-
  Top 0.152: LED6.C R10.2
L7+  (via drill 0.35)
  Top 0.152: v25.5,29.5 26.5,28.5 LED7.A
  Bottom 0.152: SJ12.1 9,28.74 9,29.5 10.2,30.7 18.44,30.7 19.25,29.89 25.11,29.89 v25.5,29.5
L7-
  Top 0.152: LED7.C R11.2
L8+  (via drill 0.35)
  Top 0.152: v28.89,29 29,28.89 LED8.A
  Bottom 0.152: SJ13.1 18.57,31 19.37,30.2 27.7,30.2 v28.89,29
L8-
  Top 0.152: LED8.C R12.2
LED1_ON
  Top 0.152: JP2.3 JP2.4
  Bottom 0.152: SJ6.2 4.83,59.09 JP2.4
LED2_ON
  Top 0.152: JP2.5 JP2.6
  Bottom 0.152: SJ7.2 4.79,56.55 JP2.6
LED3_ON
  Top 0.152: JP2.7 JP2.8
  Bottom 0.152: SJ8.2 4.75,54.01 JP2.8
LED4_ON
  Top 0.152: JP2.9 JP2.10
  Bottom 0.152: SJ9.2 4.71,51.47 JP2.10
LED5_ON
  Top 0.152: JP2.11 JP2.12
  Bottom 0.152: SJ10.2 4.67,48.93 JP2.12
LED6_ON
  Top 0.152: JP2.13 JP2.14
  Bottom 0.152: SJ11.2 4.63,46.39 JP2.14
LED7_ON
  Top 0.152: JP2.27 JP2.28
  Bottom 0.152: SJ12.2 4.38,28.5 JP2.28
LED8_ON
  Top 0.152: JP2.25 JP2.26
  Bottom 0.152: SJ13.2 4.42,31 JP2.26
LIGHT_LINE
  Top 0.152: R2.1 4.95,10.5 R1.1
  Bottom 0.152: R1.1 11.5,12 20,12 24.53,16.53 31.2,16.53 31.22,16.5 33.5,16.5 34,17 33.93,17.07 33.93,23.57 33.57,23.93 33.15,23.93 31.29,25.79 31.29,27.55 SJ1.1
LIGHT_OUT
  Top 0.152: JP4.28 JP4.27
  Bottom 0.152: SJ1.2 35.12,28 JP4.27
MCLR
  Top 0.152: JP2.1 JP2.2
POWER-  (via drill 0.35)
  Top 0.152: LED9.C 10.75,2 v11.5,2
  Bottom 0.152: v11.5,2 11.5,2.95 R25.1
RB6/PGC
  Top 0.152: JP4.4 JP4.3
RB7/PGD
  Top 0.152: JP4.2 JP4.1
RC0
  Top 0.152: JP2.29 JP2.30
RC1
  Top 0.152: JP2.31 JP2.32
RC2
  Top 0.152: JP2.33 JP2.34
RC3
  Top 0.152: JP2.35 JP2.36
RC4
  Top 0.152: JP4.36 JP4.35
RC5
  Top 0.152: JP4.34 JP4.33
RC6
  Top 0.152: JP4.32 JP4.31
RC7
  Top 0.152: JP4.30 JP4.29
RED+  (via drill 0.35)
  Top 0.152: v13,43 D1.AR
  Bottom 0.152: SJ18.1 11,42.5 11.03,42.5 12.5,42.5 v13,43
RED-  (via drill 0.35)
  Top 0.152: D1.CR R22.1
  other vias: 16.55,43
RED_ON
  Top 0.152: JP2.15 JP2.16
  Bottom 0.152: SJ18.2 5.89,43.85 JP2.16
SW_NEG  (via drill 0.35)
  Top 0.152: R21.2 19.5,15.95 19.5,14.5 18,13 13.99,13 S2.1 11.26,13.24 11,13.5 R20.2
  other vias: 11,13.55
SW_NEG2  (via drill 0.35)
  Top 0.152: R19.2 25.94,17.45 S1.1 28.51,15.5 R4.2
  other vias: 28.55,15.5
SWITCH1_OUT
  Top 0.152: JP2.37 JP2.38
  Bottom 0.152: JP2.38 5.43,17.07 5.5,17.14 5.7,17.34 5.7,19.39 6.42,20.12 6.42,21.39 7.24,22.21 SJ15.2
SWITCH2_OUT
  Top 0.152: JP2.39 JP2.40
  Bottom 0.152: SJ14.2 6,19.26 6,15.1 JP2.40
T1_LINE  (via drill 0.35)
  Top 0.152: SJ4.1 30.4,9.24 28.89,10.75 28.89,11.82 31.58,14.51 31.58,18.25 32.27,18.93 33.01,18.93 33.32,19.24 v33.32,23.32 | v30.11,29.5 30.11,32.89 29.5,33.5 25.5,33.5 22.8,36.2 22.8,42.28 20,45.09 20,69.5 v20.5,70
  Bottom 0.152: v33.32,23.32 30.11,26.54 v30.11,29.5 | v20.5,70 20.59,69.91 U1.1
T2_LINE  (via drill 0.35)
  Top 0.152: SJ3.1 36.21,9.24 35.4,8.43 33.6,8.43 33.1,8.93 30.28,8.93 28.59,10.62 28.59,11.95 31.28,14.64 31.28,18.37 32.14,19.23 32.89,19.23 32.89,22.53 v32.41,23 | v27.5,29 25.5,31 v25.5,32.89 | v19,55 18.5,55.5 17.13,55.5 U2.1
  Bottom 0.152: v32.41,23 32,23.41 32,24.21 29.8,26.41 29.8,27.5 29.3,28 28.5,28 v27.5,29 | v25.5,32.89 25.5,33.5 22.5,36.5 22.5,45 20,47.5 20,54 v19,55
TEMP1_OUT
  Top 0.152: JP4.40 JP4.39 35.73,11.99 SJ4.2
TEMP2_OUT  (via drill 0.35)
  Top 0.152: JP4.38 JP4.37 | SJ3.2 39,11.96 v38.96,12
  Bottom 0.152: v38.96,12 37.5,12 37,12.5 37,14.64 JP4.38
TRIM
  Top 0.152: R26.2 30.04,36.49 TM1.3
TRIM_JUMP
  Bottom 0.152: SJ19.2 30.24,31.5 28.5,31.5 27.5,32.5 TM1.2
TRIM_OUT
  Top 0.152: JP4.24 JP4.23
  Bottom 0.152: SJ19.1 33.5,33 34,33.5 35.5,33.5 JP4.23
VDD  (via drill 0.35)
  Top 0.152: JP2.21 JP2.22 | JP4.18 JP4.17 | SW1.12 SW1.11 | SW1.11 SW1.10 SW1.9 SW1.8 SW1.7 28.43,72.3 JP1.2 | SW1.11 17,71.49 v17,70.5 | U2.8 22.06,55.5 23,55.5 23.5,55 23.5,52 23.09,51.59 U2.5 22,51.5 24.5,49 24.5,40.5 TM1.1 | S1.3 26.25,15.25 25,16.5 21.95,16.5 C1.1 21,17.5 20,18.5 17.05,18.5 C2.1 16,17.5 14,17.5 S2.3 | v12.5,18.5 10.86,18.5 6.08,13.72 6.08,12.08 6,12 4.55,12 R2.2 2.5,9.95 2.5,8.5 3,8 6.25,8 LED9.A | JP5.2 32,6.27 v32,6.5
  Bottom 0.152: R3.2 16.05,33.64 U$2.1 | U1.8 17,69.94 v17,70.5 16,70.5 15.5,70 15.5,66.5 | U1.5 15.9,66.09 15.5,66.5 | S1.3 26.99,12.5 28,12.5 28.5,12 28.5,10.57 31.47,7.59 32,7.59 | 32,7.59 U$1.8 | S2.3 13.01,18.5 v12.5,18.5 12.5,21 8.5,25 3,25 3,31.5 4,32.5 5.5,32.5 5.5,36 | 5.5,36 4.5,36 JP2.22 | 5.5,36 R3.2 | 33.5,41.5 26,41.5 25,40.5 TM1.1 | 33.5,41.5 35.5,41.5 JP4.17 | 15.5,66.5 15.5,62 14,62 13,61 13,59 16,56 17,56 | 17,56 19,56 33.5,41.5 | 17,56 19,54 19.5,54 19.5,40 16.5,40 16.5,36 R3.2 | v32,6.5 32,7.59

### Text on the board
tNames: Board Voltage | Temperature | Trim pot | RGB LED | Humidity Sensor | Button 1 | Button 2 | CURRENT OUT | CURRENT IN | Photoresistor | BOARD ON | Board Voltage
bNames: Temperature | PIC18 Sensor & Peripheal Board / EE 310 / Created By David Story / Meadowview Lab | Current Sensor